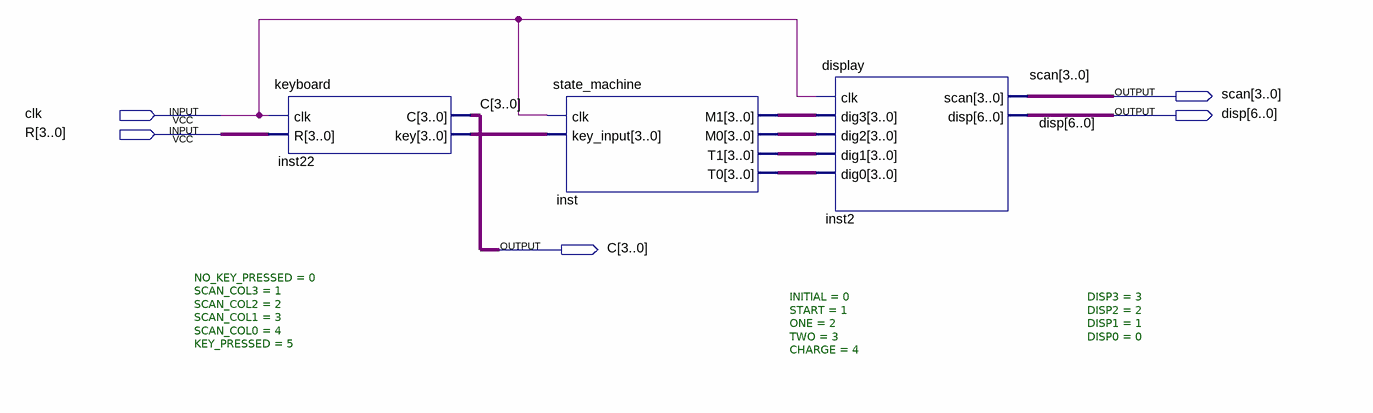
[diagram p0: schematic sheet]
// Quartus schematic EDA2.bdf as structural Verilog: 3 symbols, 5 pins
module EDA2 (
  input  clk,
  input  [3:0] R,
  output [3:0] scan,
  output [6:0] disp,
  output [3:0] C
);

  wire [3:0] inst22_key, inst_m0, inst_m1, inst_t0, inst_t1;

  keyboard #(.NO_KEY_PRESSED(0), .SCAN_COL3(1), .SCAN_COL2(2), .SCAN_COL1(3), .SCAN_COL0(4), .KEY_PRESSED(5)) inst22 (
    .clk(clk), .R(R), .C(C), .key(inst22_key));
  state_machine #(.INITIAL(0), .START(1), .ONE(2), .TWO(3), .CHARGE(4)) inst (
    .clk(clk), .key_input(inst22_key), .M1(inst_m1), .M0(inst_m0), .T1(inst_t1), .T0(inst_t0));
  display #(.DISP3(3), .DISP2(2), .DISP1(1), .DISP0(0)) inst2 (
    .clk(clk), .dig3(inst_m1), .dig2(inst_m0), .dig1(inst_t1), .dig0(inst_t0), .scan(scan), .disp(disp));
endmodule
